# Altium schematic sheet Integrated_Main_Driver_Board-05-Wireless Charging Circuit-20230110.SchDoc
size A4
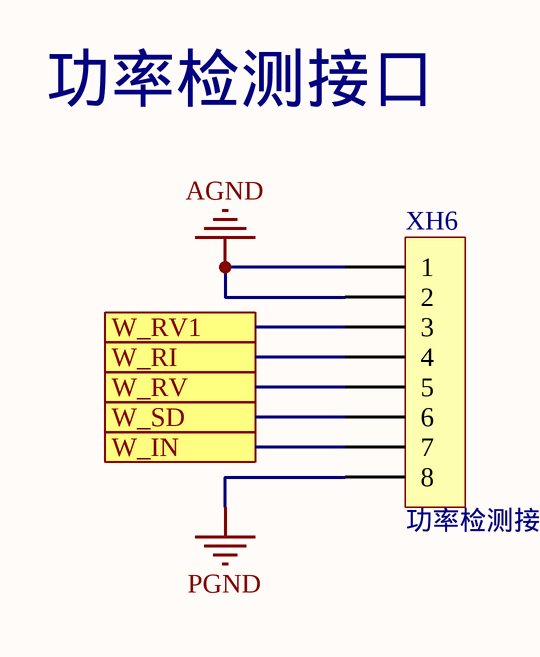
[diagram p0: Integrated_Main_Driver_Board-05-Wireless Charging Circuit-20230110.SchDoc]

## Parts
XH6  功率检测接口  [XH8/2.54mm/180]

## Ports
W_IN, W_RI, W_RV, W_RV1, W_SD

## Nets
AGND: XH6.1 XH6.2
PGND: XH6.8
W_IN: XH6.7 ; port W_IN
W_RI: XH6.4 ; port W_RI
W_RV: XH6.5 ; port W_RV
W_RV1: XH6.3 ; port W_RV1
W_SD: XH6.6 ; port W_SD

## Notes on the sheet
- 功率检测接口

## Library data of the parts
XH6 = XH8